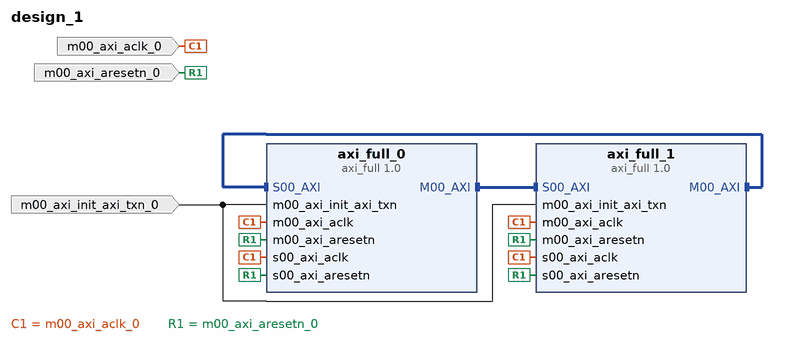
[diagram p0: block diagram of the top level]
# Vivado block design design_1, xcku060-ffva1156-2-i, Vivado 2018.3
create_bd_design design_1

create_bd_port -dir I -type clk m00_axi_aclk_0
create_bd_port -dir I -type rst m00_axi_aresetn_0
create_bd_port -dir I m00_axi_init_axi_txn_0

create_bd_cell -type ip -vlnv xilinx.com:user:axi_full:1.0 axi_full_0
create_bd_cell -type ip -vlnv xilinx.com:user:axi_full:1.0 axi_full_1

# ---- connections ----

connect_bd_intf_net [get_bd_intf_pins axi_full_0/M00_AXI] [get_bd_intf_pins axi_full_1/S00_AXI]
connect_bd_intf_net [get_bd_intf_pins axi_full_1/M00_AXI] [get_bd_intf_pins axi_full_0/S00_AXI]
connect_bd_net -net m00_axi_aclk_0_1 [get_bd_ports m00_axi_aclk_0] \
  [get_bd_pins axi_full_0/m00_axi_aclk] [get_bd_pins axi_full_0/s00_axi_aclk] [get_bd_pins axi_full_1/m00_axi_aclk] \
  [get_bd_pins axi_full_1/s00_axi_aclk]
connect_bd_net -net m00_axi_aresetn_0_1 [get_bd_ports m00_axi_aresetn_0] \
  [get_bd_pins axi_full_0/m00_axi_aresetn] [get_bd_pins axi_full_0/s00_axi_aresetn] [get_bd_pins axi_full_1/m00_axi_aresetn] \
  [get_bd_pins axi_full_1/s00_axi_aresetn]
connect_bd_net -net m00_axi_init_axi_txn_0_1 [get_bd_ports m00_axi_init_axi_txn_0] \
  [get_bd_pins axi_full_0/m00_axi_init_axi_txn] [get_bd_pins axi_full_1/m00_axi_init_axi_txn]

# ---- address map ----
assign_bd_address -offset 0x76000000 -range 64K -target_address_space [get_bd_addr_spaces axi_full_0/M00_AXI] [get_bd_addr_segs axi_full_1/S00_AXI/S00_AXI_mem]
assign_bd_address -offset 0x76000000 -range 64K -target_address_space [get_bd_addr_spaces axi_full_1/M00_AXI] [get_bd_addr_segs axi_full_0/S00_AXI/S00_AXI_mem]

validate_bd_design
save_bd_design
